# EAGLE schematic Adafruit_NeoMatrix_8x8 v2 (EAGLE 8.6.1)
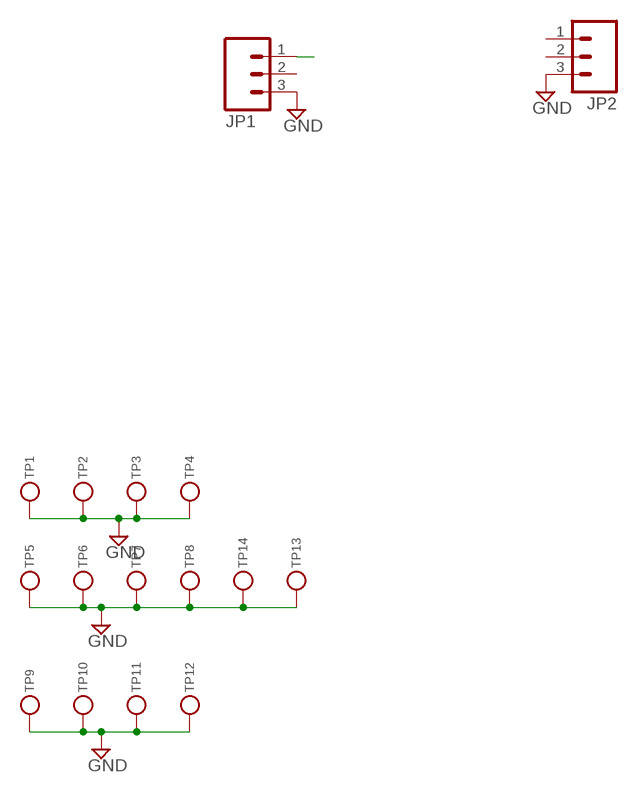
[diagram p0: schematic, sheet 1]

## Parts
JP1  M03PTH  [1X03]
JP2  M03PTH  [1X03]
TP1  TESTPOINT  [TESTPOINT_SMT]
TP2  TESTPOINT  [TESTPOINT_SMT]
TP3  TESTPOINT  [TESTPOINT_SMT]
TP4  TESTPOINT  [TESTPOINT_SMT]
TP5  TESTPOINT  [TESTPOINT_SMT]
TP6  TESTPOINT  [TESTPOINT_SMT]
TP7  TESTPOINT  [TESTPOINT_SMT]
TP8  TESTPOINT  [TESTPOINT_SMT]
TP9  TESTPOINT  [TESTPOINT_SMT]
TP10  TESTPOINT  [TESTPOINT_SMT]
TP11  TESTPOINT  [TESTPOINT_SMT]
TP12  TESTPOINT  [TESTPOINT_SMT]
TP13  TESTPOINT  [TESTPOINT_SMT]
TP14  TESTPOINT  [TESTPOINT_SMT]

## Nets
GND: JP1.3 JP2.3 TP1.P$1 TP2.P$1 TP3.P$1 TP4.P$1 TP5.P$1 TP6.P$1 TP7.P$1 TP8.P$1 TP9.P$1 TP10.P$1 TP11.P$1 TP12.P$1 TP13.P$1 TP14.P$1
N$10: JP1.1
Unconnected: JP1.2 JP2.1 JP2.2

## Library data of the parts
JP1 JP2 = neomatrix-8x8:M03: Header 3 Standard 3-pin 0.1" header. Use with straight break away headers (SKU : PRT-00116), right angle break away headers (PRT-00553), swiss pins (PRT-00743), machine pins (PRT-00117), and female headers (PRT-00115). Molex polarized connector foot print use with SKU : PRT-08232 with associated crimp pins and housings.
TP1-TP14 = microbuilder:TESTPOINT: Test Point Various test points for characterisation and PCB testing TESTPOINT_SMT - Compact Surface Mount Test Point [Digikey: 5016KTR-ND]